# EAGLE design Sensor_PCB_Electrochemical (EAGLE 7.6.0)
CNAME: Electrochemical gas sensor PCB; CREVISION: 02
Assembly variants: ESP8266 CH340 default
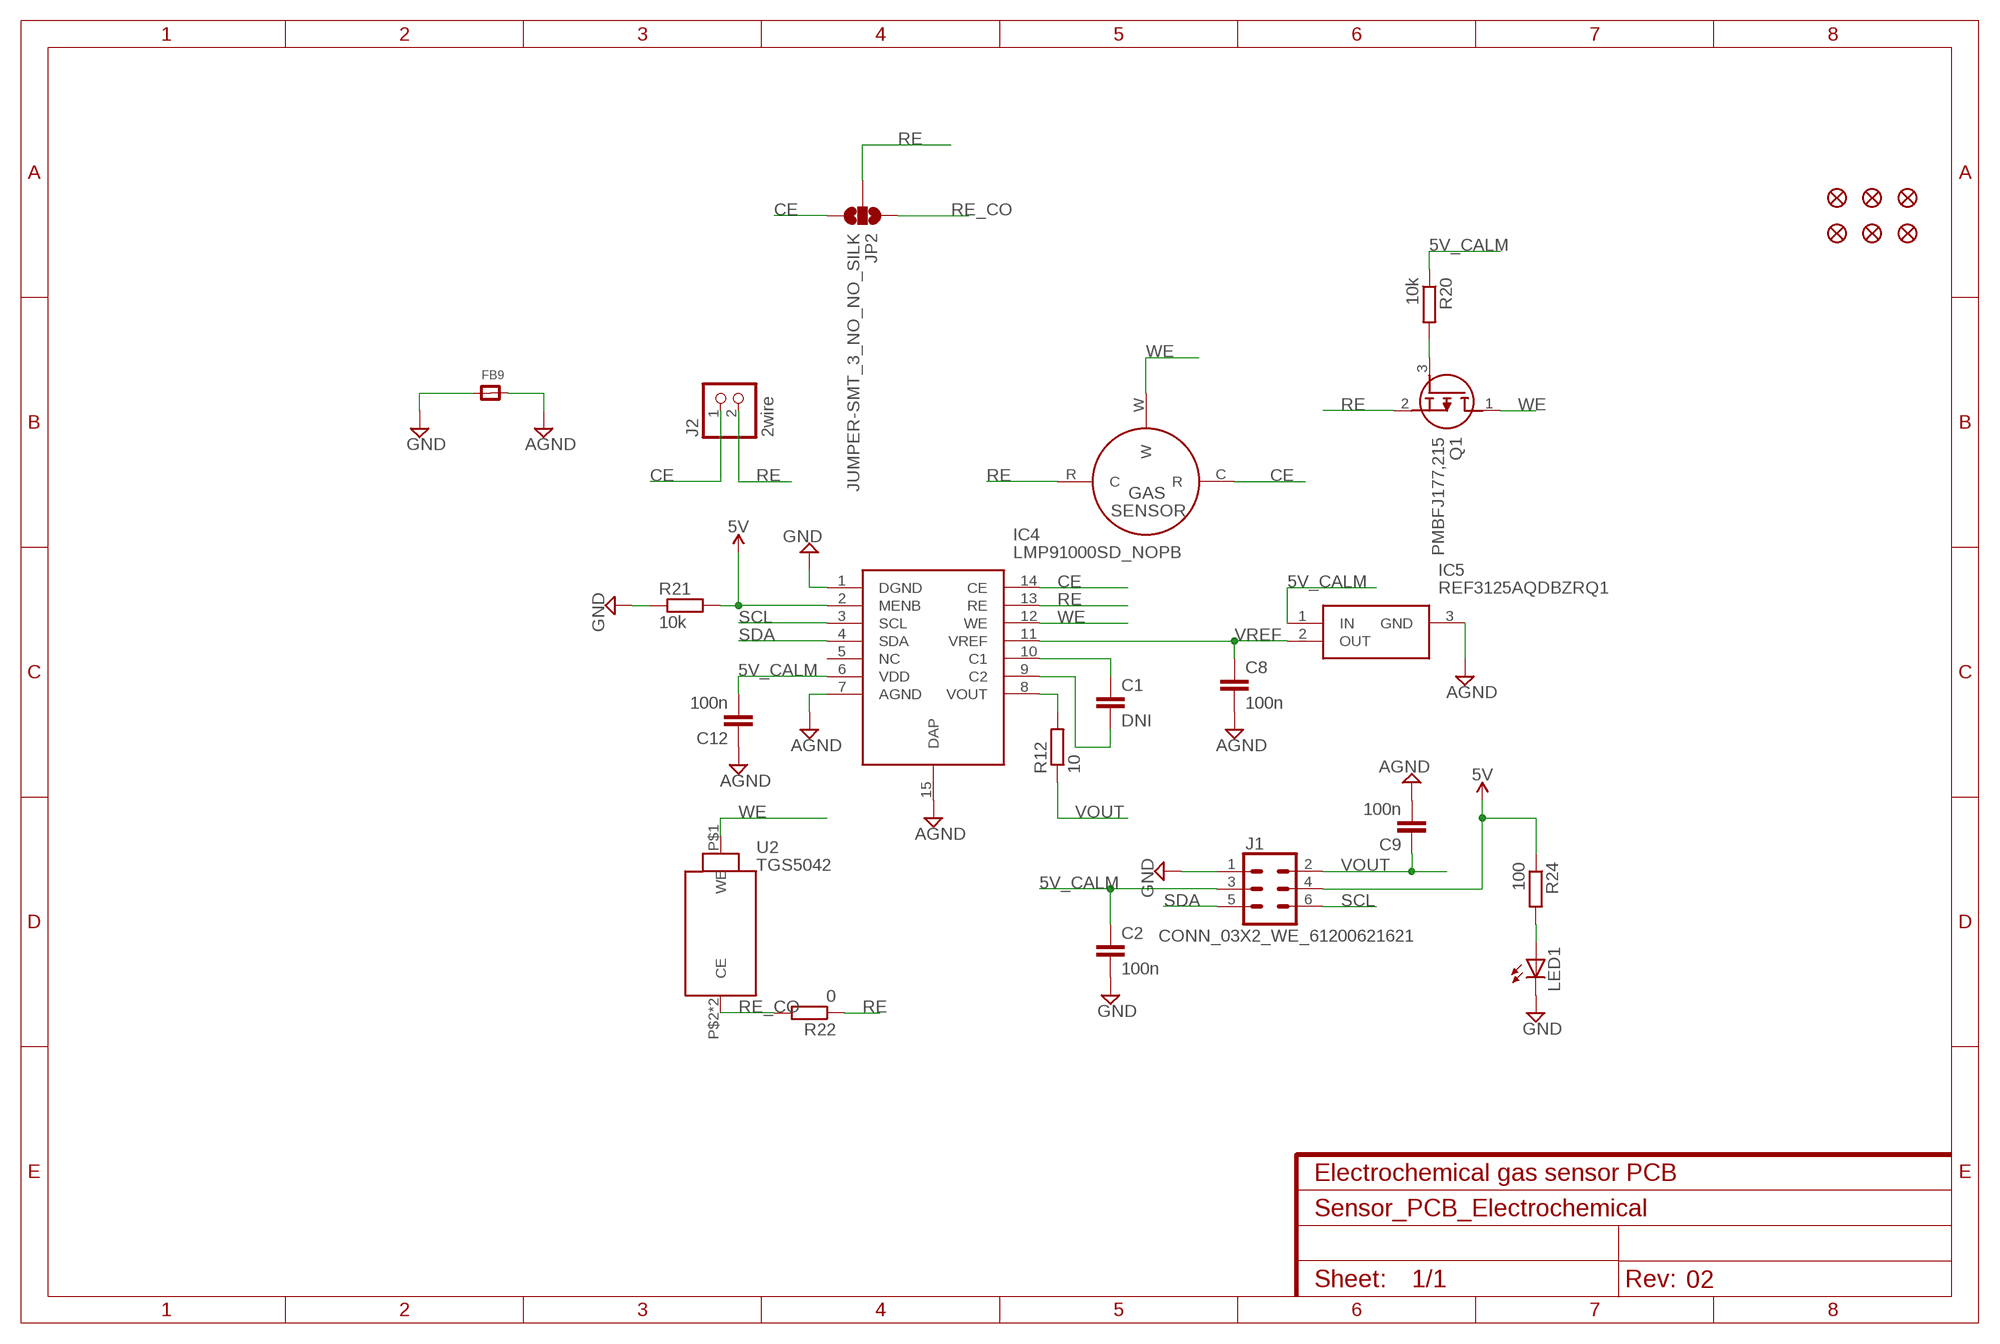
[diagram p0: schematic, sheet 1]

## Parts
C1  DNI  C-EUC0603K  [C0603K]
C2  100n  C-EUC0603K  [C0603K]
C8  100n  C-EUC0603K  [C0603K]
C9  100n  C-EUC0603K  [C0603K]
C12  100n  C-EUC0603K  [C0603K]
FB9  FERRITE  [0603]
FID3  FIDUCIAL1X1UNMASKED  [FIDUCIAL_1MM_UNMASKED]
FID5  FIDUCIAL1X1UNMASKED  [FIDUCIAL_1MM_UNMASKED]
FID6  FIDUCIAL1X1UNMASKED  [FIDUCIAL_1MM_UNMASKED]
FID7  FIDUCIAL1X1UNMASKED  [FIDUCIAL_1MM_UNMASKED]
FID8  FIDUCIAL1X1UNMASKED  [FIDUCIAL_1MM_UNMASKED]
FID9  FIDUCIAL1X1UNMASKED  [FIDUCIAL_1MM_UNMASKED]
IC4  LMP91000SD_NOPB  [SON50P400X400X80-15N]
IC5  REF3125AQDBZRQ1  [SOT95P237X112-3N]
J1  CONN_03X2_WE_61200621621  [WE_61200621621]
J2  2wire  PINHD-1X2  [1X02]
JP2  JUMPER-SMT_3_NO_NO_SILK  [SMT-JUMPER_3_0-NO_TRACE_NO-SILK]
LED1  LEDCHIP-LED0603  [CHIP-LED0603]
Q1  PMBFJ177,215  [SOT95P230X110-3N]
R12  10  R-EU_R0603  [R0603]
R20  10k  R-EU_R0603  [R0603]
R21  10k  R-EU_R0603  [R0603]
R22  0  R-EU_R0603  [R0603]
R24  100  R-EU_R0603  [R0603]
U2  TGS5042  [TGS5042]
X1  3-ELECTRODE-GAS-SENSOR_SOCKET  [3-ELE_SOCKET_ANDON]

## Nets
5V: IC4.2(MENB) J1.4 R21.2 R24.1
5V_CALM: C2.1 C12.2 IC4.6(VDD) IC5.1(IN) J1.3 R20.1
AGND: C8.2 C9.2 C12.1 FB9.2 IC4.7(AGND) IC4.15(DAP) IC5.3(GND)
CE: IC4.14(CE) J2.1 JP2.3 X1.C(R)
GND: C2.2 FB9.1 IC4.1(DGND) J1.1 LED1.C R21.1
N$1: LED1.A R24.2
N$2: C1.1 IC4.10(C1)
N$3: IC4.8(VOUT) R12.2
N$4: C1.2 IC4.9(C2)
N$9: Q1.3(G) R20.2
RE: IC4.13(RE) J2.2 JP2.2 Q1.2(S) R22.1 X1.R(C)
RE_CO: JP2.1 R22.2 U2.P$2(CE) U2.P$3(CE)
SCL: IC4.3(SCL) J1.6
SDA: IC4.4(SDA) J1.5
VOUT: C9.1 J1.2 R12.1
VREF: C8.1 IC4.11(VREF) IC5.2(OUT)
WE: IC4.12(WE) Q1.1(D) U2.P$1(WE) X1.W
Unconnected: IC4.5(NC)

## Library data of the parts
C1 = resistor:C-EU: CAPACITOR, European symbol
C2 C8 C9 C12 = resistor:C-EU: CAPACITOR, European symbol; PARTNO: GRM188R71C104KA01D
FB9 = microbuilder:FERRITE: Ferrite Bead 0603 MMZ1608B121C - 120 Ohm @ 100MHz, 600mA, 0.15 Ohm DC Resistance - Digikey: 445-2164-1-ND BK1608HW121-T - 120 Ohm, 600mA Ferrite Chip - Digikey: 587-1876-2-ND 0805 HZ0805B272R-10 - 2.7K Ohm @ 100MHz, 200mA, 0.8 Ohm DC Resistance - Digikey: 240-2504-1-ND (see also Murata BLM21BD272SN1L) MMZ2012Y152B - 1.5K Ohm @ 100MHz, 500mA, 0.4 Ohm DC Resistance - Digikey: 445-1560-1-ND - Mainly for high frequency (80-400MHz) MMZ2012R102A - 1K Ohm @ 100MHz, 500mA, 0.3 Ohm DC Resistance - Digikey: 445-1555-2-ND - More general purpose (10-200MHz); PARTNO: BLM18PG121SN1D
FID3 FID5-FID9 = microbuilder:FIDUCIAL: Fiducial Alignment Points Various fiducial points for machine vision alignment.
IC4 = SamacSys_Parts:LMP91000SD_NOPB: Configurable AFE Potentiostat for Low-Power Chemical Sensing Applications Source: Datasheet <http://www.ti.com/lit/ds/symlink/lmp91000.pdf>; DESCRIPTION: Configurable AFE Potentiostat for Low-Power Chemical Sensing Applications; HEIGHT: 0.8mm; MANUFACTURER_NAME: Texas Instruments; MANUFACTURER_PART_NUMBER: LMP91000SD/NOPB; MOUSER_PART_NUMBER: 926-LMP91000SD/NOPB; MOUSER_PRICE-STOCK: https://www.mouser.com/Search/Refine.aspx?Keyword=926-LMP91000SD%2FNOPB; PARTNO: LMP91000
IC5 = SamacSys_Parts:REF3125AQDBZRQ1: Automotive 20-ppm/C (max), 100-A, 3-pin SOT-23 series voltage reference Source: Datasheet <http://www.ti.com/lit/gpn/ref31-q1>; DESCRIPTION: Automotive 20-ppm/C (max), 100-A, 3-pin SOT-23 series voltage reference; HEIGHT: 1.12mm; MANUFACTURER_NAME: Texas Instruments; MANUFACTURER_PART_NUMBER: REF3125AQDBZRQ1; MOUSER_PART_NUMBER: 595-REF3125AQDBZRQ1; MOUSER_PRICE-STOCK: https://www.mouser.com/Search/Refine.aspx?Keyword=595-REF3125AQDBZRQ1; PARTNO: REF3125AQDBZRQ1
J1 = FRA_eagle_lib:CONN_03X2_WE_61200621621: https://eu.mouser.com/ProductDetail/Wurth-Elektronik/61200621621?qs=sGAEpiMZZMs%252BGHln7q6pm%2FFhW%252BtWvhAgbNxkR%252BlwXp8Ip%2FAN9J9VOg%3D%3D https://eu.mouser.com/datasheet/2/445/6120xx21621-265830.pdf; PARTNO: 30306-6002HB
J2 = pinhead:PINHD-1X2: PIN HEADER; PARTNO: TSW-102-07-G-S
JP2 = SparkFun-Jumpers:JUMPER-SMT_3_NO: Normally open jumper This jumper has three pads in close proximity to each other. Apply solder to close the connection(s).
LED1 = adafruit:LED: LED OSRAM: - CHIPLED LG R971, LG N971, LY N971, LG Q971, LY Q971, LO R971, LY R971 LH N974, LH R974 LS Q976, LO Q976, LY Q976 LO Q996 - Hyper CHIPLED LW Q18S LB Q993, LB Q99A, LB R99A - SideLED LS A670, LO A670, LY A670, LG A670, LP A670 LB A673, LV A673, LT A673, LW A673 LH A674 LY A675 LS A676, LA A676, LO A676, LY A676, LW A676 LS A679, LY A679, LG A679 - Hyper Micro SIDELED® LS Y876, LA Y876, LO Y876, LY Y876 LT Y87S - SmartLED LW L88C, LW L88S LB L89C, LB L89S, LG L890 LS L89K, LO L89K, LY L89K LS L896, LA L896, LO L896, LY L896 - TOPLED LS T670, LO T670, LY T670, LG T670, LP T670 LSG T670, LSP T670, LSY T670, LOP T670, LYG T670 LG T671, LOG T671, LSG T671 LB T673, LV T673, LT T673, LW T673 LH T674 LS T676, LA T676, LO T676, LY T676, LB T676, LH T676, LSB T676, LW T676 LB T67C, LV T67C, LT T67C, LS T67K, LO T67K, LY T67K, LW E67C LS E67B, LA E67B, LO E67B, LY E67B, LB E67C, LV E67C, LT E67C LW T67C LS T679, LY T679, LG T679 LS T770, LO T770, LY T770, LG T770, LP T770 LB T773, LV T773, LT T773, LW T773 LH T774 LS E675, LA E675, LY E675, LS T675 LS T776, LA T776, LO T776, LY T776, LB T776 LHGB T686 LT T68C, LB T68C - Hyper Mini TOPLED® LB M676 - Mini TOPLED Santana® LG M470 LS M47K, LO M47K, LY M47K Source: http://www.osram.convergy.de/; PARTNO: IN-S63AT5G
Q1 = SamacSys_Parts:PMBFJ177,215: NXP PMBFJ177,215 P-channel JFET Transistor, 30 V, Idss 1.5 20mA, 3-Pin SOT-23 Source: Datasheet <https://componentsearchengine.com/Datasheets/1/PMBFJ177,215.pdf>; DESCRIPTION: NXP PMBFJ177,215 P-channel JFET Transistor, 30 V, Idss 1.5 20mA, 3-Pin SOT-23; HEIGHT: 1.1mm; MANUFACTURER_NAME: Nexperia; MANUFACTURER_PART_NUMBER: PMBFJ177,215; MOUSER_PART_NUMBER: 771-PMBFJ177-T/R; MOUSER_PRICE-STOCK: https://www.mouser.com/Search/Refine.aspx?Keyword=771-PMBFJ177-T%2FR; PARTNO: PMBFJ177,215
R12 = resistor:R-EU_: RESISTOR, European symbol; PARTNO: CRCW060310R0FKEA
R20 R21 = resistor:R-EU_: RESISTOR, European symbol; PARTNO: CRCW060310K0FKEA
R22 = resistor:R-EU_: RESISTOR, European symbol; PARTNO: CRCW06030000Z0EA
R24 = resistor:R-EU_: RESISTOR, European symbol; PARTNO: CRCW0603100RFKEA
U2 = FRA_eagle_lib:TGS5042: TGS5042 CO sensor; PARTNO: INSTALLED_BY_CUSTOMER
X1 = gas-sensor:3-ELECTRODE-GAS-SENSOR: 3 electrode electrochemical sensors; PARTNO: INSTALLED_BY_CUSTOMER

## Board
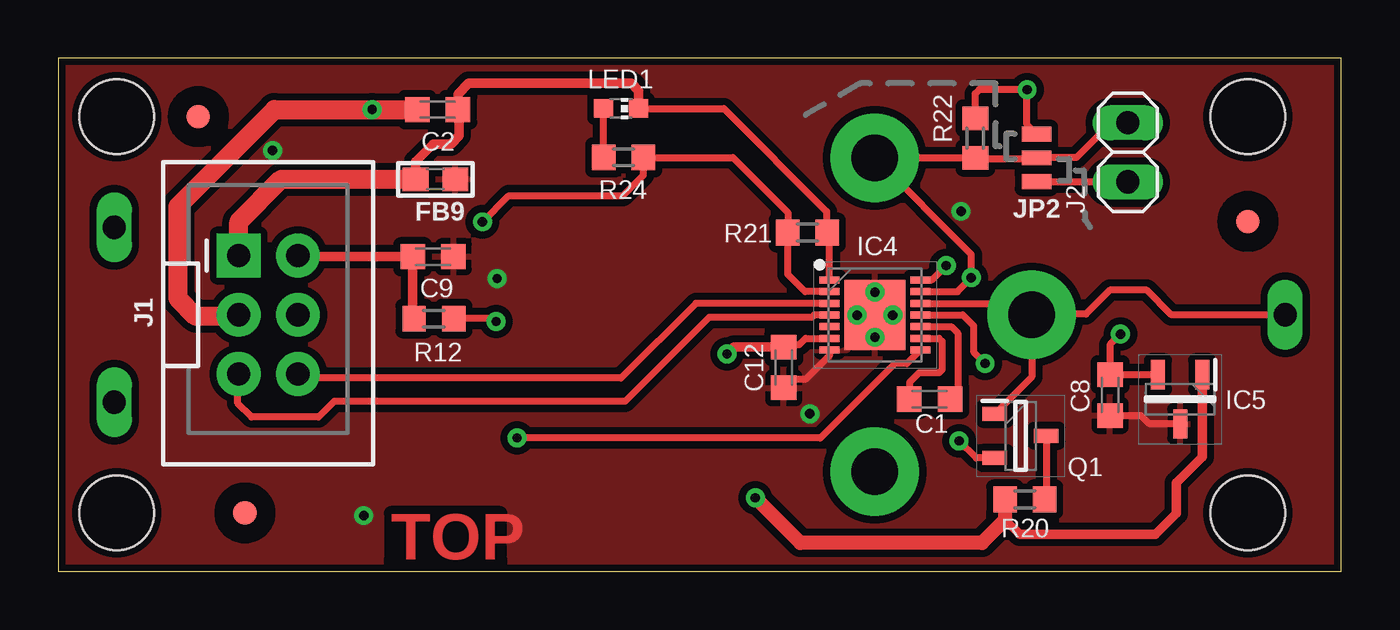
[diagram p1: board, top side]
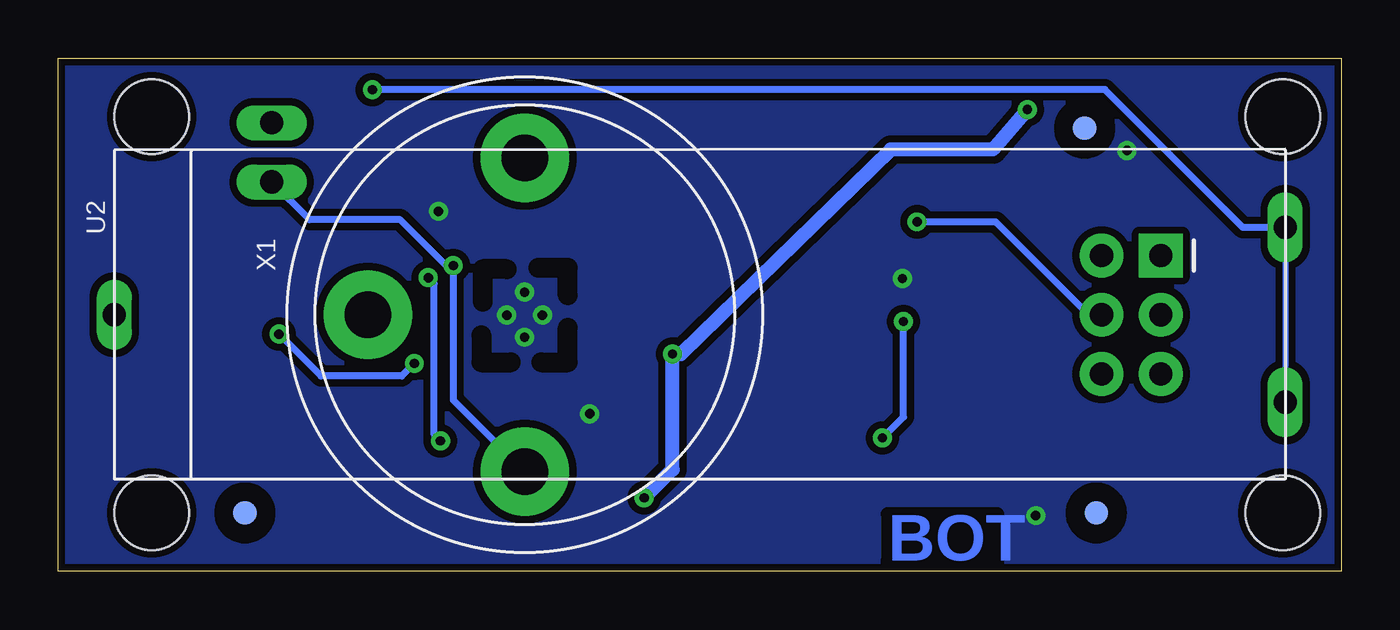
[diagram p2: board, bottom side, seen from below]

Size 55 x 22 mm. Coordinates in mm from the lower left corner, seen from the top.
Outline: 0,0 55,0 55,22 0,22 0,0
Copper layers (1*16): Top 0.035mm / dielectric 1.6mm / Bottom 0.035mm
Design rules "AllPCB": minimum track width 6mil, minimum drill 0.399mm, track to track 0.149859375mm, track to pad 0.149859375mm, pad to pad 8mil, via to via 17mil, smd to smd 6mil, copper to edge 10mil, drill to drill 24mil, minimum pad ring 10mil, minimum via ring 8mil, stop-mask expansion 4mil, vias tented up to drill 0.3mm, thermal gap 10mil
Holes 3.2 mm at 2.5,2.5 2.5,19.5 51,2.5 51,19.5
bRestrict: 8 lines

### Footprints (pad centres in the part's own frame; a part is rotated, then mirrored left to right if it is on the bottom)
C0603K = smd 1.05 x 1.08: 1 -0.875,0; 2 0.875,0
0603 = smd 1.1 x 1: 1 -0.85,0; 2 0.85,0
FIDUCIAL_1MM_UNMASKED = smd 1 x 1: 1 0,0
SON50P400X400X80-15N = smd 0.85 x 0.3: 1 -1.95,1.5; 2 -1.95,1; 3 -1.95,0.5; 4 -1.95,0; 5 -1.95,-0.5; 6 -1.95,-1; 7 -1.95,-1.5; 8 1.95,-1.5; 9 1.95,-1; 10 1.95,-0.5; 11 1.95,0; 12 1.95,0.5; 13 1.95,1; 14 1.95,1.5 | smd 2.6 x 3: 15 0,0
SOT95P237X112-3N = smd 1.25 x 0.6: 1 -1.05,0.95; 2 -1.05,-0.95; 3 1.05,0
WE_61200621621 = drill 1 pad 1.88 square: 1 -1.27,2.54 | drill 1 pad 1.88: 2 1.27,2.54; 3 -1.27,0; 4 1.27,0; 5 -1.27,-2.54; 6 1.27,-2.54
1X02 = drill 1 long: 1 -1.27,0; 2 1.27,0
SMT-JUMPER_3_0-NO_TRACE_NO-SILK = smd 0.635 x 1.27: 1 -1.016,0; 2 0,0; 3 1.016,0
CHIP-LED0603 = smd 0.8 x 0.8: A 0,-0.75; C 0,0.75
SOT95P230X110-3N = smd 1.05 x 0.6: 1 -1.1,0.95; 2 -1.1,-0.95; 3 1.1,0
R0603 = smd 1 x 1.1: 1 -0.85,0; 2 0.85,0
TGS5042 = drill 1 long: P$1 0,25.1; P$2 -3.75,-25.1; P$3 3.75,-25.1
3-ELE_SOCKET_ANDON = drill 2 pad 3.81: C -6.73,0; R 6.73,0; W 0,6.73

### Placement (x,y rotation side)
C1  37.35,7.38 180 top
C2  16.26,19.8 0 top
C8  45.09,7.55 270 top
C9  16.07,13.49 0 top
C12  31.1,8.74 90 top
DRILEGEND  [DRILEGEND]  -0.13,-4.94 0 top  (outside the outline)
FB9  16.17,16.81 0 top
FID3  8,2.5 0 top
FID5  6,19.5 0 top
FID6  51,15 0 top
FID7  47,2.5 0 bottom
FID8  11,19 0 bottom
FID9  10.5,2.5 0 bottom
IC4  35.01,10.99 0 top
IC5  48.09,7.38 270 top
J1  9,11 0 top
J2  45.85,17.97 90 top
JP2  41.94,17.73 270 top
LED1  24.13,19.84 270 top
Q1  41.25,5.81 0 top
R12  16.1,10.83 0 top
R20  41.44,3.08 0 top
R21  32.12,14.52 180 top
R22  39.31,18.58 90 top
R24  24.23,17.75 180 top
U2  27.5,11 90 bottom
X1  35,11 90 bottom

### Tracks (layer width: path | path; a pad name or v marks a point on that pad's centre or on a via)
5V  (via drill 0.4 pad 0.81)
  Top 0.305: IC4.2 32.02,11.99 31.27,12.73 R21.2 31.27,14.53 31.27,15.39 28.91,17.75 R24.1 | R24.1 25.1,17.73 27.09,17.73 | v18.18,14.98 19.3,16.11 24.21,16.11 25.08,16.98 R24.1
  Bottom 0.305: J1.4 10.82,11 14.8,14.98 v18.18,14.98
5V_CALM  (via drill 0.4 pad 0.81)
  Top 0.305: C12.2 31.12,9.99 31.4,9.72 31.77,9.72 32.04,9.99 IC4.6
  Top 0.406: 40.59,2.21 41.22,1.57 47.02,1.57 47.92,2.48 47.92,3.78 49.04,4.9 IC5.1 | v28.66,9.31 28.96,9.61 C12.2
  Top 0.61: R20.1 40.59,2.21 39.6,1.22 31.82,1.22 v29.88,3.15 | C2.1 v13.46,19.8
  Top 0.813: J1.3 7.67,10.94 5.89,10.94 5.13,11.7 5.13,15.66 9.27,19.8 C2.1
  Bottom 0.61: v29.88,3.15 28.66,4.37 v28.66,9.31 28.3,9.31 19.3,18.09 14.94,18.09 v13.46,19.8
AGND  (via drill 0.4 pad 0.81)
  Top 0.305: C8.2 46.42,6.68 46.76,6.34 48.07,6.34 IC5.3 | IC4.7 33.06,9.26 32.04,8.23 31.13,8.23 C12.1
  other vias: 18.81,12.55 32.22,6.75 38.7,15.44 13.1,2.38 35.01,11.97 35.01,10.04 35.77,10.98 34.24,10.98 9.18,18.05
  pour Top (isolate 0.305): 0,22 0,0 54.99,0 54.99,22
  pour Bottom (isolate 0.305): 0,22 54.99,22 54.99,0 0,0
CE  (via drill 0.4 pad 0.81)
  Top 0.305: J2.1 41.96,16.7 JP2.3 | IC4.14 37.45,12.49 v38.07,13.11
  Bottom 0.305: X1.C 38.07,7.34 v38.07,13.11 38.38,13.11 40.34,15.07 44.23,15.07 J2.1
GND
  Top 0.305: IC4.1 33.06,14.43 R21.1 32.94,14.55 32.94,15.44 28.53,19.84 LED1.C
  Top 0.406: C2.2 17.19,19.74 17.19,18.68 16.83,18.32 16.07,18.32 15.32,17.57 FB9.1 | LED1.C 24.89,19.85 24.89,20.61 24.57,20.93 17.59,20.93 17.14,20.46 C2.2 | C2.2
  Top 0.813: J1.1 7.74,14.98 9.56,16.81 FB9.1
N$1
  Top 0.305: R24.2 LED1.A
N$2
  Top 0.305: IC4.10 38.29,10.49 38.56,10.21 38.56,7.72 C1.1
N$3  (via drill 0.4 pad 0.81)
  Top 0.305: IC4.8 36.38,8.91 35.87,8.91 32.67,5.71 v19.66,5.71 | v18.77,10.71 18.64,10.83 R12.2
  Bottom 0.305: v19.66,5.71 18.77,6.62 v18.77,10.71
N$4
  Top 0.305: IC4.9 37.75,9.99 37.89,9.86 37.89,8.64 37.76,8.51 36.9,8.51 36.49,8.1 36.49,7.4 C1.2
N$9
  Top 0.305: Q1.3 42.35,3.15 R20.2
RE  (via drill 0.4 pad 0.81)
  Top 0.305: IC4.13 38.55,11.99 v39.14,12.59 39.14,13.08 39.14,13.59 X1.R R22.1 39.35,17.7 41.91,17.7 JP2.2 | JP2.2 | JP2.2 41.95,17.75 43.66,17.75 45.15,19.24 J2.2 | Q1.2 39.35,4.86 v38.62,5.59
  Bottom 0.305: v38.62,5.59 38.88,5.85 38.88,12.33 v39.14,12.59
RE_CO  (via drill 0.4 pad 0.81)
  Top 0.305: R22.2 39.31,20.49 39.48,20.66 v41.53,20.66 41.53,19.15 JP2.1
  Bottom 0.254: U2.P$3 U2.P$2
  Bottom 0.305: U2.P$3 4.22,14.75 10.12,20.66 v41.53,20.66
SCL
  Top 0.305: IC4.3 27.33,11.49 24.12,8.28 10.45,8.28 J1.6
SDA
  Top 0.305: IC4.4 32.41,10.99 32.31,10.89 27.9,10.89 24.3,7.29 11.84,7.29 11.16,6.62 8.28,6.62 7.7,7.2 7.7,8.43 J1.5
VOUT
  Top 0.406: J1.2 10.32,13.49 C9.1 15.19,10.89 R12.1
VREF  (via drill 0.4 pad 0.81)
  Top 0.305: IC5.2 C8.1 45.09,9.72 v45.54,10.17 | IC4.11 38.78,10.99 39.24,10.53 39.24,9.4 v39.73,8.91
  Bottom 0.305: v39.73,8.91 40.27,8.37 43.74,8.37 v45.54,10.17
WE
  Top 0.305: IC4.12 41.24,11.49 X1.W | X1.W 41.73,8.33 Q1.1 | U2.P$1 47.73,11 46.66,12.06 45.09,12.06 44.05,11.03 41.76,11.03 X1.W

### Text on the board
Top: TOP
Bottom: BOT
tDocu: short / for / CO | short for / 2-wire
bDocu: J. Repcik / 08/2019 | El-Chem / gas / sensor v1 | TGS5042